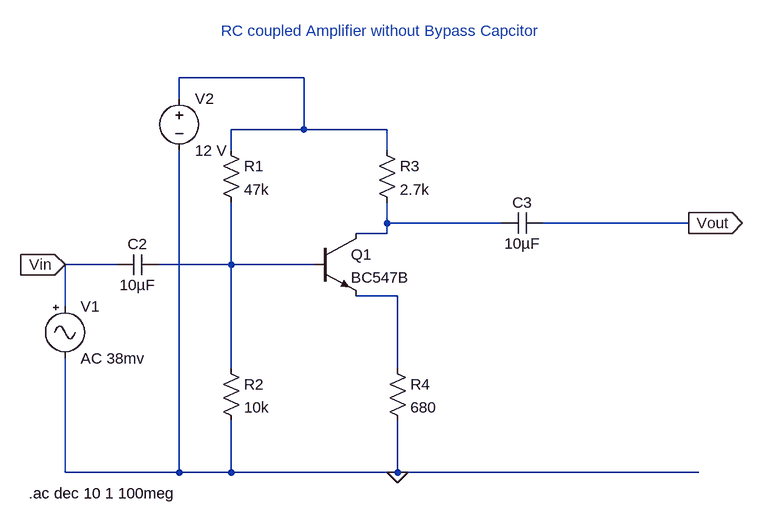
[diagram p0: schematic rcCoupleAmp3.asc]
rcCoupleAmp3.asc, the LTspice schematic file:
Version 4
SHEET 1 880 680
WIRE 32 -96 -160 -96
WIRE -160 -64 -160 -96
WIRE 32 -16 32 -96
WIRE 32 -16 -80 -16
WIRE 160 -16 32 -16
WIRE -80 16 -80 -16
WIRE 160 16 160 -16
WIRE 160 128 160 96
WIRE 336 128 160 128
WIRE 624 128 400 128
WIRE 160 144 160 128
WIRE 160 144 112 144
WIRE -256 192 -336 192
WIRE -80 192 -80 96
WIRE -80 192 -192 192
WIRE 48 192 -80 192
WIRE 176 240 112 240
WIRE -336 256 -336 192
WIRE -80 352 -80 192
WIRE 176 352 176 240
WIRE -336 512 -336 336
WIRE -160 512 -160 16
WIRE -160 512 -336 512
WIRE -80 512 -80 432
WIRE -80 512 -160 512
WIRE 176 512 176 432
WIRE 176 512 -80 512
WIRE 640 512 176 512
FLAG 176 512 0
FLAG -336 192 Vin
IOPIN -336 192 In
FLAG 624 128 Vout
IOPIN 624 128 Out
SYMBOL Misc\\signal -336 240 R0
WINDOW 123 0 0 Left 0
WINDOW 39 0 0 Left 0
SYMATTR InstName V1
SYMATTR Value AC 38mv
SYMBOL npn 48 144 R0
SYMATTR InstName Q1
SYMATTR Value BC547B
SYMBOL res -96 0 R0
SYMATTR InstName R1
SYMATTR Value 47k
SYMBOL res -96 336 R0
SYMATTR InstName R2
SYMATTR Value 10k
SYMBOL res 144 0 R0
SYMATTR InstName R3
SYMATTR Value 2.7k
SYMBOL res 160 336 R0
SYMATTR InstName R4
SYMATTR Value 680
SYMBOL cap -192 176 R90
WINDOW 0 0 32 VBottom 2
WINDOW 3 32 32 VTop 2
SYMATTR InstName C2
SYMATTR Value 10µF
SYMBOL cap 400 112 R90
WINDOW 0 0 32 VBottom 2
WINDOW 3 32 32 VTop 2
SYMATTR InstName C3
SYMATTR Value 10µF
SYMBOL voltage -160 -80 R0
SYMATTR InstName V2
SYMATTR Value 12 V
TEXT -392 544 Left 2 !.ac dec 10 1 100meg
TEXT -96 -168 Left 2 ;RC coupled Amplifier without Bypass Capcitor

The netlist it stands for:
* rcCoupleAmp3.asc
V1 Vin 0 AC 38mv
Q1 N002 N003 N004 0 BC547B
R1 N001 N003 47k
R2 N003 0 10k
R3 N001 N002 2.7k
R4 N004 0 680
C2 N003 Vin 10µF
C3 Vout N002 10µF
V2 N001 0 12 V
.model NPN NPN
.model PNP PNP
.lib standard.bjt
.ac dec 10 1 100meg
* RC coupled Amplifier without Bypass Capcitor
.backanno
.end